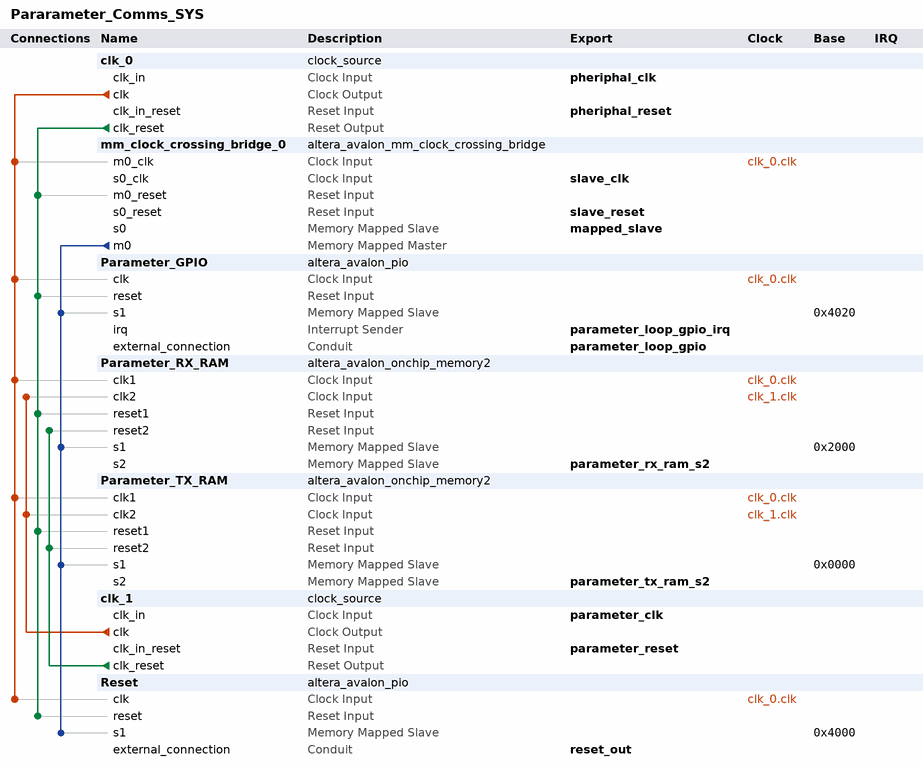
[diagram p0: system contents]
# Platform Designer (Qsys) system Pararameter_Comms_SYS, MAX 10 10M50DAF484I7G
# Parameters at their usual value, and those the tool derives, are not listed.
package require -exact qsys 18.1
create_system Pararameter_Comms_SYS
set_project_property DEVICE_FAMILY {MAX 10}
set_project_property DEVICE 10M50DAF484I7G

add_instance clk_0 clock_source 18.1
set_instance_parameter_value clk_0 clockFrequency 50000000

add_instance mm_clock_crossing_bridge_0 altera_avalon_mm_clock_crossing_bridge 18.1
set_instance_parameter_value mm_clock_crossing_bridge_0 ADDRESS_WIDTH 15
set_instance_parameter_value mm_clock_crossing_bridge_0 COMMAND_FIFO_DEPTH 4
set_instance_parameter_value mm_clock_crossing_bridge_0 DATA_WIDTH 32
set_instance_parameter_value mm_clock_crossing_bridge_0 MASTER_SYNC_DEPTH 2
set_instance_parameter_value mm_clock_crossing_bridge_0 MAX_BURST_SIZE 1
set_instance_parameter_value mm_clock_crossing_bridge_0 RESPONSE_FIFO_DEPTH 4
set_instance_parameter_value mm_clock_crossing_bridge_0 SLAVE_SYNC_DEPTH 2
set_instance_parameter_value mm_clock_crossing_bridge_0 USE_AUTO_ADDRESS_WIDTH 0

add_instance Parameter_GPIO altera_avalon_pio 18.1
set_instance_parameter_value Parameter_GPIO bitModifyingOutReg true
set_instance_parameter_value Parameter_GPIO captureEdge true
set_instance_parameter_value Parameter_GPIO direction InOut
set_instance_parameter_value Parameter_GPIO edgeType FALLING
set_instance_parameter_value Parameter_GPIO generateIRQ true
set_instance_parameter_value Parameter_GPIO irqType EDGE
set_instance_parameter_value Parameter_GPIO width 1

add_instance Parameter_RX_RAM altera_avalon_onchip_memory2 18.1
set_instance_parameter_value Parameter_RX_RAM dataWidth 32
set_instance_parameter_value Parameter_RX_RAM dualPort true
set_instance_parameter_value Parameter_RX_RAM initMemContent false
set_instance_parameter_value Parameter_RX_RAM initializationFileName onchip_mem.hex
set_instance_parameter_value Parameter_RX_RAM memorySize 4100

add_instance Parameter_TX_RAM altera_avalon_onchip_memory2 18.1
set_instance_parameter_value Parameter_TX_RAM dataWidth 32
set_instance_parameter_value Parameter_TX_RAM dualPort true
set_instance_parameter_value Parameter_TX_RAM initMemContent false
set_instance_parameter_value Parameter_TX_RAM initializationFileName onchip_mem.hex
set_instance_parameter_value Parameter_TX_RAM memorySize 4100

add_instance clk_1 clock_source 18.1
set_instance_parameter_value clk_1 clockFrequency 50000000

add_instance Reset altera_avalon_pio 18.1
set_instance_parameter_value Reset bitModifyingOutReg true
set_instance_parameter_value Reset captureEdge true
set_instance_parameter_value Reset direction Output
set_instance_parameter_value Reset edgeType FALLING
set_instance_parameter_value Reset generateIRQ true
set_instance_parameter_value Reset irqType EDGE
set_instance_parameter_value Reset width 1

# connections
add_connection clk_0.clk mm_clock_crossing_bridge_0.m0_clk clock
add_connection clk_0.clk Parameter_GPIO.clk clock
add_connection clk_0.clk Parameter_RX_RAM.clk1 clock
add_connection clk_0.clk Parameter_TX_RAM.clk1 clock
add_connection clk_0.clk Reset.clk clock
add_connection clk_1.clk Parameter_RX_RAM.clk2 clock
add_connection clk_1.clk Parameter_TX_RAM.clk2 clock
add_connection clk_0.clk_reset mm_clock_crossing_bridge_0.m0_reset reset
add_connection clk_0.clk_reset Parameter_GPIO.reset reset
add_connection clk_0.clk_reset Parameter_RX_RAM.reset1 reset
add_connection clk_0.clk_reset Parameter_TX_RAM.reset1 reset
add_connection clk_0.clk_reset Reset.reset reset
add_connection clk_1.clk_reset Parameter_RX_RAM.reset2 reset
add_connection clk_1.clk_reset Parameter_TX_RAM.reset2 reset
add_connection mm_clock_crossing_bridge_0.m0 Parameter_GPIO.s1 avalon
set_connection_parameter_value mm_clock_crossing_bridge_0.m0/Parameter_GPIO.s1 baseAddress 0x4020
add_connection mm_clock_crossing_bridge_0.m0 Parameter_RX_RAM.s1 avalon
set_connection_parameter_value mm_clock_crossing_bridge_0.m0/Parameter_RX_RAM.s1 baseAddress 0x2000
add_connection mm_clock_crossing_bridge_0.m0 Parameter_TX_RAM.s1 avalon
set_connection_parameter_value mm_clock_crossing_bridge_0.m0/Parameter_TX_RAM.s1 baseAddress 0x0000
add_connection mm_clock_crossing_bridge_0.m0 Reset.s1 avalon
set_connection_parameter_value mm_clock_crossing_bridge_0.m0/Reset.s1 baseAddress 0x4000

# exported interfaces
add_interface mapped_slave avalon slave
set_interface_property mapped_slave EXPORT_OF mm_clock_crossing_bridge_0.s0
add_interface parameter_clk clock sink
set_interface_property parameter_clk EXPORT_OF clk_1.clk_in
add_interface parameter_loop_gpio conduit end
set_interface_property parameter_loop_gpio EXPORT_OF Parameter_GPIO.external_connection
add_interface parameter_loop_gpio_irq interrupt sender
set_interface_property parameter_loop_gpio_irq EXPORT_OF Parameter_GPIO.irq
add_interface parameter_reset reset sink
set_interface_property parameter_reset EXPORT_OF clk_1.clk_in_reset
add_interface parameter_rx_ram_s2 avalon slave
set_interface_property parameter_rx_ram_s2 EXPORT_OF Parameter_RX_RAM.s2
add_interface parameter_tx_ram_s2 avalon slave
set_interface_property parameter_tx_ram_s2 EXPORT_OF Parameter_TX_RAM.s2
add_interface pheriphal_clk clock sink
set_interface_property pheriphal_clk EXPORT_OF clk_0.clk_in
add_interface pheriphal_reset reset sink
set_interface_property pheriphal_reset EXPORT_OF clk_0.clk_in_reset
add_interface reset_out conduit end
set_interface_property reset_out EXPORT_OF Reset.external_connection
add_interface slave_clk clock sink
set_interface_property slave_clk EXPORT_OF mm_clock_crossing_bridge_0.s0_clk
add_interface slave_reset reset sink
set_interface_property slave_reset EXPORT_OF mm_clock_crossing_bridge_0.s0_reset

set_interconnect_requirement {$system} qsys_mm.clockCrossingAdapter HANDSHAKE
set_interconnect_requirement {$system} qsys_mm.enableEccProtection FALSE
set_interconnect_requirement {$system} qsys_mm.insertDefaultSlave FALSE
set_interconnect_requirement {$system} qsys_mm.maxAdditionalLatency 1

save_system Pararameter_Comms_SYS.qsys
